# Altium project SD.PrjPcb
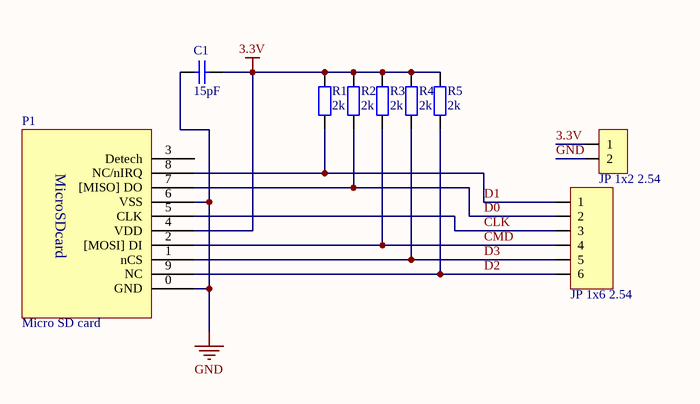
[diagram p0: SD.SchDoc]
1 sheet, 9 parts. Net scope: global (net labels, ports and power ports of the same name join across sheets).
Board file: SD.PcbDoc

## Sheet SD.SchDoc
size A4

### Parts
C1  15pF  [tu 0805]
JP1  JP 1x6 2.54  [JP 1x6 DT]
JP3  JP 1x2 2.54  [JP 1x2 DT]
P1  Micro SD card  [MicroSD]
R1  2k  [tro smd 0805]
R2  2k  [tro smd 0805]
R3  2k  [tro smd 0805]
R4  2k  [tro smd 0805]
R5  2k  [tro smd 0805]

### Nets
3.3V: C1.1 JP3.1 P1.4(VDD) R1.2 R2.2 R3.2 R4.2 R5.2
GND: C1.2 JP3.2 P1.0(GND) P1.6(VSS)
CLK: JP1.3 P1.5(CLK)
CMD: JP1.4 P1.2([MOSI]_DI) R3.1
D0: JP1.2 P1.7([MISO]_DO) R2.1
D1: JP1.1 P1.8(NC/nIRQ) R1.1
D2: JP1.6 P1.9(NC) R5.1
D3: JP1.5 P1.1(nCS) R4.1

Not connected (* = marked no-connect by the designer): P1 3(Detech)

### Notes on the sheet
- (in symbol Micro SD card) MicroSDcard

### Library data of the parts
C1 = Tu 0805 15pF 50V 10%: Dán; Don_Vi: Con; So_Chan: 2; Ten_Linh_Kien: Tụ 0805 15P 10% 50V; Ma_Hang: MH004556; Chung_Loai: Dán; Kieu_Chan: *
JP1 = JP 1x6 2.54 Duc Thang: Cắm; Ten_Linh_Kien: Jump Đơn Đực 2.54MM 1x40P Thẳng 11MM; Don_Vi: Con; Ma_Hang: MH000903; Ghi_Chu: *; Kieu_Chan: *; Chung_Loai: Cắm
JP3 = JP 1x2 2.54 Duc Thang: Cắm; Ten_Linh_Kien: Jump Đơn Đực 2.54MM 1x40P Thẳng 11MM; Don_Vi: Con; Ma_Hang: MH000903; Ghi_Chu: *; Kieu_Chan: *; Chung_Loai: Cắm
R1-R5 = Tro 0805 1% 2k: Dán; Don_Vi: Con; So_Chan: 2; Ten_Linh_Kien: Trở 0805 1% 2k; Ma_Hang: MH005471; Chung_Loai: Dán; Kieu_Chan: *